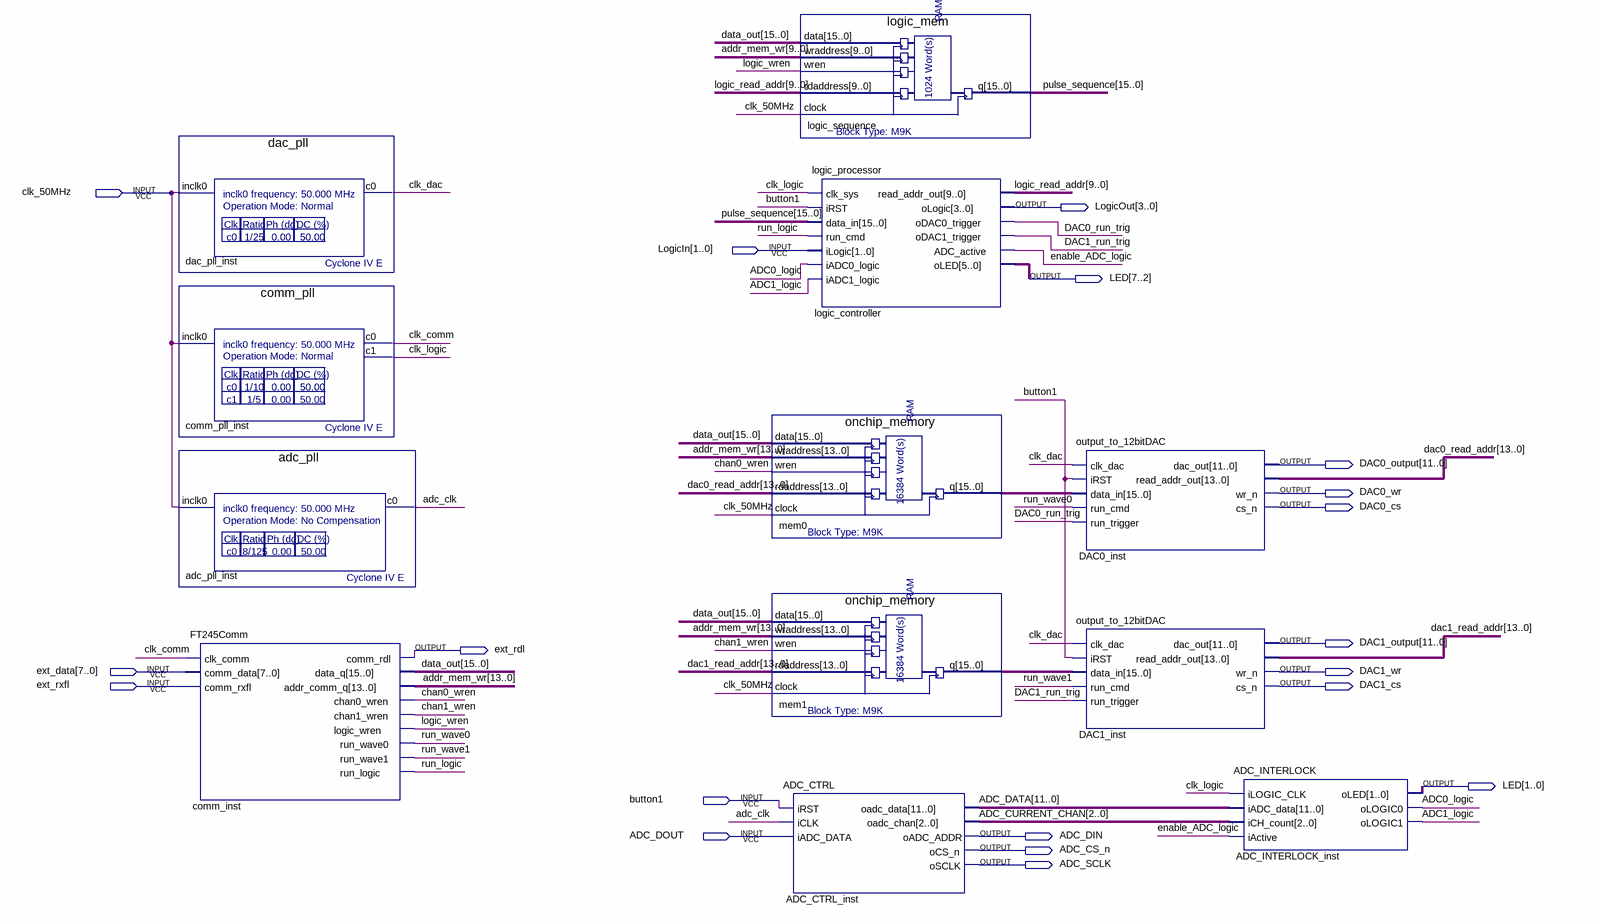
[diagram p0: schematic sheet]
// Quartus schematic DE0_myfirstfpga.bdf as structural Verilog: 12 symbols, 19 pins
module DE0_myfirstfpga (
  input  clk_50MHz,
  input  [1:0] LogicIn,
  input  [7:0] ext_data,
  input  ext_rxfl,
  input  button1,
  input  ADC_DOUT,
  output [3:0] LogicOut,
  output [7:0] LED,
  output [11:0] DAC0_output,
  output DAC0_wr,
  output DAC0_cs,
  output [11:0] DAC1_output,
  output ext_rdl,
  output DAC1_wr,
  output DAC1_cs,
  output ADC_DIN,
  output ADC_CS_n,
  output ADC_SCLK
);

  wire ADC0_logic, ADC1_logic, adc_clk, chan0_wren, chan1_wren, clk_comm, clk_dac, clk_logic, DAC0_run_trig,
       DAC1_run_trig, enable_ADC_logic, logic_wren, run_logic, run_wave0, run_wave1;
  wire [2:0] ADC_CURRENT_CHAN;
  wire [9:0] logic_read_addr;
  wire [11:0] ADC_DATA;
  wire [13:0] addr_mem_wr, dac0_read_addr, dac1_read_addr;
  wire [15:0] data_out, mem0_q, mem1_q, pulse_sequence;

  dac_pll dac_pll_inst (.inclk0(clk_50MHz), .c0(clk_dac));
  comm_pll comm_pll_inst (.inclk0(clk_50MHz), .c0(clk_comm), .c1(clk_logic));
  adc_pll adc_pll_inst (.inclk0(clk_50MHz), .c0(adc_clk));
  FT245Comm comm_inst (
    .clk_comm(clk_comm), .comm_data(ext_data), .comm_rxfl(ext_rxfl), .comm_rdl(ext_rdl), .data_q(data_out),
    .addr_comm_q(addr_mem_wr), .chan0_wren(chan0_wren), .chan1_wren(chan1_wren), .logic_wren(logic_wren),
    .run_wave0(run_wave0), .run_wave1(run_wave1), .run_logic(run_logic));
  logic_mem logic_sequence (
    .data(data_out), .wraddress(addr_mem_wr[9:0]), .wren(logic_wren), .rdaddress(logic_read_addr),
    .clock(clk_50MHz), .q(pulse_sequence));
  onchip_memory mem0 (
    .data(data_out), .wraddress(addr_mem_wr), .wren(chan0_wren), .rdaddress(dac0_read_addr),
    .clock(clk_50MHz), .q(mem0_q));
  onchip_memory mem1 (
    .data(data_out), .wraddress(addr_mem_wr), .wren(chan1_wren), .rdaddress(dac1_read_addr),
    .clock(clk_50MHz), .q(mem1_q));
  ADC_CTRL ADC_CTRL_inst (
    .iRST(button1), .iCLK(adc_clk), .iADC_DATA(ADC_DOUT), .oadc_data(ADC_DATA), .oadc_chan(ADC_CURRENT_CHAN),
    .oADC_ADDR(ADC_DIN), .oCS_n(ADC_CS_n), .oSCLK(ADC_SCLK));
  logic_processor logic_controller (
    .clk_sys(clk_logic), .iRST(button1), .data_in(pulse_sequence), .run_cmd(run_logic), .iLogic(LogicIn),
    .iADC0_logic(ADC0_logic), .iADC1_logic(ADC1_logic), .read_addr_out(logic_read_addr), .oLogic(LogicOut),
    .oDAC0_trigger(DAC0_run_trig), .oDAC1_trigger(DAC1_run_trig), .ADC_active(enable_ADC_logic),
    .oLED(LED[7:2]));
  output_to_12bitDAC DAC0_inst (
    .clk_dac(clk_dac), .iRST(button1), .data_in(mem0_q), .run_cmd(run_wave0), .run_trigger(DAC0_run_trig),
    .dac_out(DAC0_output), .read_addr_out(dac0_read_addr), .wr_n(DAC0_wr), .cs_n(DAC0_cs));
  output_to_12bitDAC DAC1_inst (
    .clk_dac(clk_dac), .iRST(button1), .data_in(mem1_q), .run_cmd(run_wave1), .run_trigger(DAC1_run_trig),
    .dac_out(DAC1_output), .read_addr_out(dac1_read_addr), .wr_n(DAC1_wr), .cs_n(DAC1_cs));
  ADC_INTERLOCK ADC_INTERLOCK_inst (
    .iLOGIC_CLK(clk_logic), .iADC_data(ADC_DATA), .iCH_count(ADC_CURRENT_CHAN), .iActive(enable_ADC_logic),
    .oLED(LED[1:0]), .oLOGIC0(ADC0_logic), .oLOGIC1(ADC1_logic));
endmodule
